# EAGLE schematic PCB_Benoit (EAGLE 9.5.2)
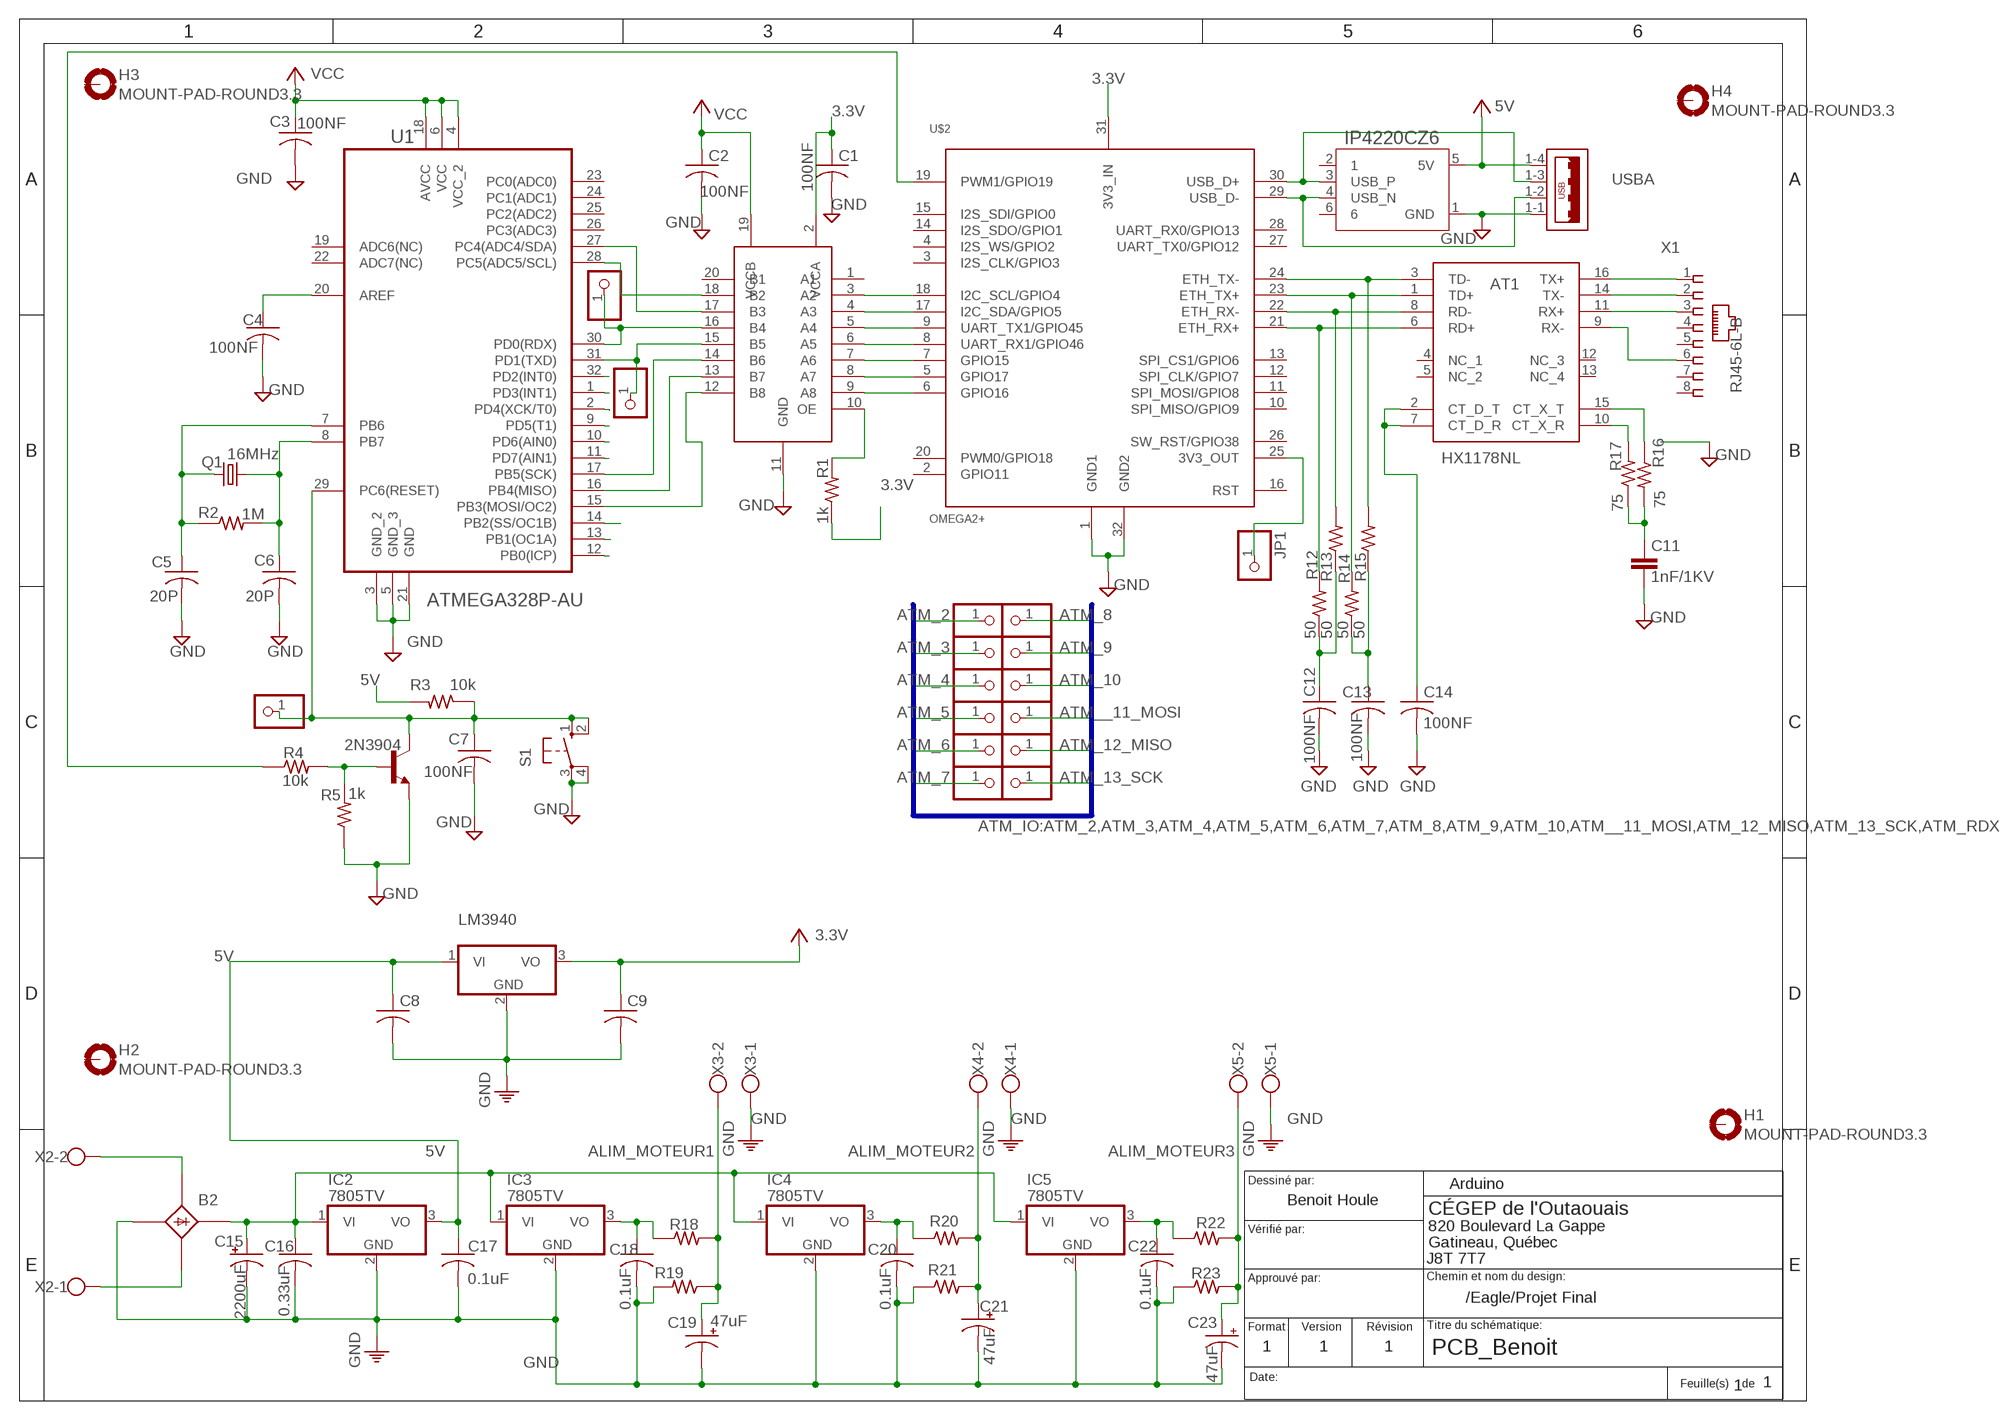
[diagram p0: schematic, sheet 1]

## Parts
AT1  HX1178NL  [SOP254P1283X647-16N]
B2  B25A-  [B25A-]
C1  100NF  CENPC0603K  [C0603K]
C2  100NF  CENPC0603K  [C0603K]
C3  100NF  CENPC0603K  [C0603K]
C4  100NF  CENPC0603K  [C0603K]
C5  20P  CENPC0603K  [C0603K]
C6  20P  CENPC0603K  [C0603K]
C7  100NF  CENPC0603K  [C0603K]
C8  CENPC1206K  [C1206K]
C9  CENPC1206K  [C1206K]
C11  1nF/1KV  CXC10B6  [XC10B6]
C12  100NF  CENPC0603K  [C0603K]
C13  100NF  CENPC0603K  [C0603K]
C14  100NF  CENPC0603K  [C0603K]
C15  2200uF  CPOL-USSANYO_B'  [SANYO-OSCON_B']
C16  0.33uF  CENPC0603K  [C0603K]
C17  0.1uF  CENPC0603K  [C0603K]
C18  0.1uF  CENPC0603K  [C0603K]
C19  47uF  CPOL-USSANYO_B'  [SANYO-OSCON_B']
C20  0.1uF  CENPC0603K  [C0603K]
C21  47uF  CPOL-USSANYO_B'  [SANYO-OSCON_B']
C22  0.1uF  CENPC0603K  [C0603K]
C23  47uF  CPOL-USSANYO_B'  [SANYO-OSCON_B']
FRAME1  CARTOUCHE_TGÉ  [CARTOUCHE]
H1  MOUNT-PAD-ROUND3.3  [3,3-PAD]
H2  MOUNT-PAD-ROUND3.3  [3,3-PAD]
H3  MOUNT-PAD-ROUND3.3  [3,3-PAD]
H4  MOUNT-PAD-ROUND3.3  [3,3-PAD]
IC2  7805TV  [TO220V]
IC3  7805TV  [TO220V]
IC4  7805TV  [TO220V]
IC5  7805TV  [TO220V]
IP4220CZ6  IP4220CZ6,125DIODE_SOT457_1P7X3P1-M  [DIODE_SOT457_1P7X3P1-M]
JP1  PINHD-1X1  [1X01]
JP2  PINHD-1X1  [1X01]
JP3  PINHD-1X1  [1X01]
JP4  PINHD-1X1  [1X01]
JP5  PINHD-1X1  [1X01]
JP6  PINHD-1X1  [1X01]
JP7  PINHD-1X1  [1X01]
JP8  PINHD-1X1  [1X01]
JP9  PINHD-1X1  [1X01]
JP10  PINHD-1X1  [1X01]
JP11  PINHD-1X1  [1X01]
JP12  PINHD-1X1  [1X01]
JP13  PINHD-1X1  [1X01]
JP14  PINHD-1X1  [1X01]
JP15  PINHD-1X1  [1X01]
JP16  PINHD-1X1  [1X01]
LM3940  7824TV  [TO220V]
Q1  16MHz  CRYSTALHC49S  [HC49/S]
R1  1k  RM1206  [M1206]
R2  1M  RM1206  [M1206]
R3  10k  RM1206  [M1206]
R4  10k  RM1206  [M1206]
R5  1k  RM3216  [M3216]
R12  50  RM1206  [M1206]
R13  50  RM1206  [M1206]
R14  50  RM1206  [M1206]
R15  50  RM1206  [M1206]
R16  75  RM1206  [M1206]
R17  75  RM1206  [M1206]
R18  R0309/10  [0309/10]
R19  R0309/10  [0309/10]
R20  R0309/10  [0309/10]
R21  R0309/10  [0309/10]
R22  R0309/10  [0309/10]
R23  R0309/10  [0309/10]
S1  10-XX  [B3F-10XX]
U1  ATMEGA328P-AU  [QFP80P900X900X120-32N]
U$1  TXS0108E  [TSSOP20]
U$2  OMEGA2+  [OMEGA2_PADS]
USB  USB_2P85-32003-00X-1  [USB2]
VERIFIER_TYPE  2N3904  [TO92]
X1  RJ45-6L-B  [RJ45-NO-SHIELD]
X2  W237-102  [W237-102]
X3  W237-102  [W237-102]
X4  W237-102  [W237-102]
X5  W237-102  [W237-102]

## Nets
3.3V: C1.1 C9.1 LM3940.3(VO) R1.1 U$1.2(VCCA) U$2.31(3V3_IN)
5V: C2.1 C3.1 C8.1 C17.1 IC2.3(VO) IP4220CZ6.5(5V) LM3940.1(VI) R3.2 U1.4(VCC_2) U1.6(VCC) U1.18(AVCC) U$1.19(VCCB) USB.1-4 ; supply symbol labelled VCC
ALIM_MOTEUR1: C19.+ R18.2 R19.1 X3.2
ALIM_MOTEUR2: C21.+ R20.2 R21.2 X4.2
ALIM_MOTEUR3: C23.+ R22.2 R23.2 X5.2
ATM_2: JP3.1 U1.32(PD2(INT0))
ATM_3: JP4.1 U1.1(PD3(INT1))
ATM_4: JP7.1 U1.2(PD4(XCK/T0))
ATM_5: JP8.1 U1.9(PD5(T1))
ATM_6: JP9.1 U1.10(PD6(AIN0))
ATM_7: JP10.1 U1.11(PD7(AIN1))
ATM_8: JP11.1 U1.12(PB0(ICP))
ATM_9: JP12.1 U1.13(PB1(OC1A))
ATM_10: JP13.1 U1.14(PB2(SS/OC1B))
ATM_12_MISO: JP15.1 U1.16(PB4(MISO)) U$1.13(B7)
ATM_13_SCK: JP16.1 U1.17(PB5(SCK)) U$1.14(B6)
ATM__11_MOSI: JP14.1 U1.15(PB3(MOSI/OC2)) U$1.12(B8)
ATM_RDX: JP5.1 U1.30(PD0(RDX)) U$1.16(B4)
ATM_SCI: U1.28(PC5(ADC5/SCL)) U$1.18(B2)
ATM_SDA: U1.27(PC4(ADC4/SDA)) U$1.17(B3)
ATM_TDX: JP6.1 U1.31(PD1(TXD)) U$1.15(B5)
GND: B2.-1(-) C1.2 C2.2 C3.2 C4.2 C5.2 C6.2 C7.2 C8.2 C9.2 C11.2 C12.2 C13.2 C14.2 C15.- C16.2 C17.2 C18.2 C19.- C20.2 C21.- C22.2 C23.- IC2.2(GND) IC3.2(GND) IC4.2(GND) IC5.2(GND) IP4220CZ6.1(GND) LM3940.2(GND) R5.1 R19.2 R21.1 R23.1 S1.3(P) S1.4(P1) U1.3(GND_2) U1.5(GND_3) U1.21(GND) U$1.11(GND) U$2.1(GND1) U$2.32(GND2) USB.1-1 VERIFIER_TYPE.3(E) X3.1 X4.1 X5.1
MCU_RESET: C7.1 JP2.1 R3.1 S1.1(S) S1.2(S1) U1.29(PC6(RESET)) VERIFIER_TYPE.1(C)
N$1: R1.2 U$1.10(OE)
N$2: C4.1 U1.20(AREF)
N$3: C6.1 Q1.2 R2.2 U1.8(PB7)
N$4: C5.1 Q1.1 R2.1 U1.7(PB6)
N$6: C11.1 R16.2 R17.1
N$7: AT1.2(CT_D_T) AT1.7(CT_D_R) C14.1
N$8: AT1.15(CT_X_T) R16.1
N$9: AT1.10(CT_X_R) R17.2
N$10: R4.1 U$2.19(PWM1/GPIO19)
N$11: B2.AC1-(AC1) X2.2
N$12: B2.AC2-(AC2) X2.1
N$13: C18.1 IC3.3(VO) R18.1
N$15: C20.1 IC4.3(VO) R20.1
N$18: C22.1 IC5.3(VO) R22.1
N$25: R4.2 R5.2 VERIFIER_TYPE.2(B)
N$28: IP4220CZ6.3(USB_P) U$2.30(USB_D+) USB.1-3
N$30: IP4220CZ6.4(USB_N) U$2.29(USB_D-) USB.1-2
N$36: AT1.3(TD-) R15.2 U$2.24(ETH_TX-)
N$37: AT1.1(TD+) R14.2 U$2.23(ETH_TX+)
N$38: AT1.8(RD-) R13.2 U$2.22(ETH_RX-)
N$39: AT1.6(RD+) R12.2 U$2.21(ETH_RX+)
N$40: AT1.16(TX+) X1.1
N$41: AT1.14(TX-) X1.2
N$42: AT1.11(RX+) X1.3
N$43: AT1.9(RX-) X1.6
N$47: C12.1 R12.1 R13.1
N$48: C13.1 R14.1 R15.1
OM_IO15: U$1.7(A6) U$2.7(GPIO15)
OM_IO16: U$1.9(A8) U$2.6(GPIO16)
OM_IO17: U$1.8(A7) U$2.5(GPIO17)
OM_RXD1: U$1.6(A5) U$2.8(UART_RX1/GPIO46)
OM_SCI: U$1.3(A2) U$2.18(I2C_SCL/GPIO4)
OM_SDA: U$1.4(A3) U$2.17(I2C_SDA/GPIO5)
OM_TXD1: U$1.5(A4) U$2.9(UART_TX1/GPIO45)
TP_3.3_OMEGA: JP1.1 U$2.25(3V3_OUT)
VIN_7805: B2.+1(+) C15.+ C16.1 IC2.1(VI) IC3.1(VI) IC4.1(VI) IC5.1(VI)
Unconnected: AT1.4(NC_1) AT1.5(NC_2) AT1.12(NC_3) AT1.13(NC_4) B2.+ B2.- B2.AC1 B2.AC2 H1.B3,3(MOUNT) H2.B3,3(MOUNT) H3.B3,3(MOUNT) H4.B3,3(MOUNT) IP4220CZ6.2 IP4220CZ6.6 U1.19(ADC6(NC)) U1.22(ADC7(NC)) U1.23(PC0(ADC0)) U1.24(PC1(ADC1)) U1.25(PC2(ADC2)) U1.26(PC3(ADC3)) U$1.1(A1) U$1.20(B1) U$2.2(GPIO11) U$2.3(I2S_CLK/GPIO3) U$2.4(I2S_WS/GPIO2) U$2.10(SPI_MISO/GPIO9) U$2.11(SPI_MOSI/GPIO8) U$2.12(SPI_CLK/GPIO7) U$2.13(SPI_CS1/GPIO6) U$2.14(I2S_SDO/GPIO1) U$2.15(I2S_SDI/GPIO0) U$2.16(RST) U$2.20(PWM0/GPIO18) U$2.26(SW_RST/GPIO38) U$2.27(UART_TX0/GPIO12) U$2.28(UART_RX0/GPIO13) USB.2-1 USB.2-2 USB.2-3 USB.2-4 X1.4 X1.5 X1.7 X1.8

## Buses
ATM_IO:ATM_2,ATM_3,ATM_4,ATM_5,ATM_6,ATM_7,ATM_8,ATM_9,ATM_10,ATM__11_MOSI,ATM_12_MISO,ATM_13_SCK,ATM_RDX,ATM_TDX

## Notes on the sheet
- Arduino
- Benoit Houle
- /Eagle/Projet Final
- 1 | 1 | 1
- 1 | 1

## Library data of the parts
AT1 = SamacSys_Parts:HX1178NL: Audio Transformers / Signal Transformers 10/100Base-T SMD 1-Port Source: Datasheet <https://ms.componentsearchengine.com/Datasheets/1/HX1178NL.pdf>; DESCRIPTION: Audio Transformers / Signal Transformers 10/100Base-T SMD 1-Port; HEIGHT: 6.47mm; MANUFACTURER_NAME: Pulse; MANUFACTURER_PART_NUMBER: HX1178NL
B2 = rectifier:B25A-: RECTIFIER 25-A bridge
C1-C9 C12-C14 C16-C18 C20 C22 = 1_TGE-sur G:CENP: Condensateur electrolytique non-polarisé
C11 = 1_TGE-sur G:C: Condensateur
C15 C19 C21 C23 = rcl:CPOL-US: POLARIZED CAPACITOR, American symbol; SPICEPREFIX: C
FRAME1 = 1_TGE-sur G:CARTOUCHE_TGÉ: Cartouche de TGÉ: Grandeur A, dimention 8 1/2 x 11 pouces, orientation portrait. Les élèves doivent utiliser la commande TEXT pour placer les valeurs aux champs appropriés. Couche 100 Cartouche, ne pas oublier de créer cette couche! Size par défaut: 0,07 ou ajusté en conséquence si pas asez d'espace. Ratio: 8% Font: Vector. Voir la commande TEXT pour plus d'information.
H1-H4 = holes:MOUNT-PAD-ROUND: MOUNTING PAD, round
IC2-IC5 LM3940 = linear:78*: Positive VOLTAGE REGULATOR Source: http://cache.national.com/ds/LM/LM78L05.pdf http://www.fairchildsemi.com/ds/LM/LM7805.pdf
IP4220CZ6 = IP4220CZ6:IP4220CZ6,125; BUILT_BY: EMA_Anthony; COPYRIGHT: Copyright (C) 2016 Accelerated Designs. All rights reserved; MANUFACTURER_PART_NUMBER: IP4220CZ6,125; VENDOR: Nexperia
JP1-JP16 = 1mylib:PINHD-1X1: PIN HEADER
Q1 = crystal:CRYSTAL: CRYSTAL; OC_FARNELL: 1667008; OC_NEWARK: unknown
R1-R5 R12-R23 = 1_TGE-sur G:R: R
S1 = switch-omron:10-XX: OMRON SWITCH; MPN: B3F-1000; OC_FARNELL: 176432; OC_NEWARK: 36M3542
U1 = Atmel_By_element14_Batch_1-00:ATMEGA328P-AU: 8-bit Microcontroller with In-System Programmable Flash; MPN: ATMEGA328P-AU; OC_FARNELL: 1715486; OC_NEWARK: 14R4631; PACKAGE: TQFP-32; SUPPLIER: Atmel
U$1 = Synapseware-transistors:TXS0108E: 8-BIT BIDIRECTIONAL VOLTAGE-LEVEL TRANSLATOR FOR OPEN-DRAIN AND PUSH-PULL APPLICATIONS
U$2 = OnionOmega2:OMEGA2+: Onion Omega2+; FLASH: 32MB; RAM: 128MB
USB = 1_TGE-sur G:USB_2P
VERIFIER_TYPE = transistor:2N3904: NPN TRANSISTOR
X1 = con-tycoelectronics:RJ45: CORCOM Modular RJ Jacks No Shield Source: www.tycoelectronics.com .. ENG_DS_1654001_1099_RJ_L_0507.pdf; MPN: RJ45-6L-B; OC_FARNELL: unknown; OC_NEWARK: 16R6090
X2-X5 = con-wago-500:W237-102: WAGO SCREW CLAMP; MPN: 237-102; OC_FARNELL: unknown; OC_NEWARK: 70K9898